# Altium schematic sheet 24_PCIE-PCIE3.0_1x4Lanes_RC_64P.SchDoc
size 594 x 420 mm; SheetNumber: 36; SheetTotal: 43
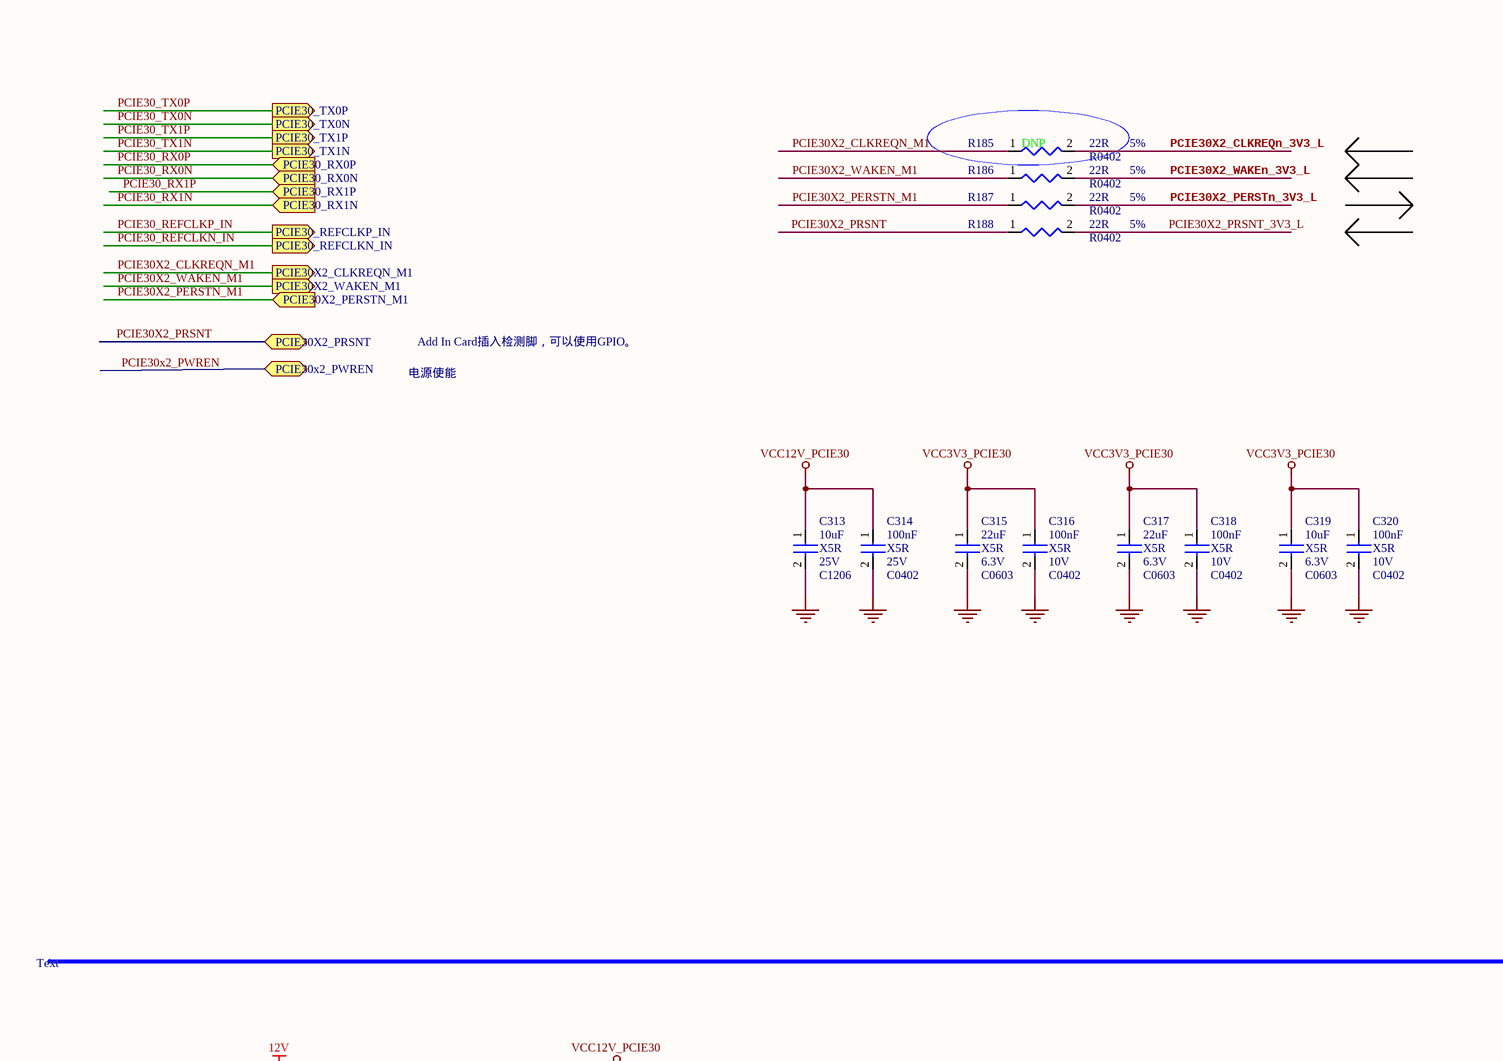
[diagram p0: 24_PCIE-PCIE3.0_1x4Lanes_RC_64P.SchDoc, top left]
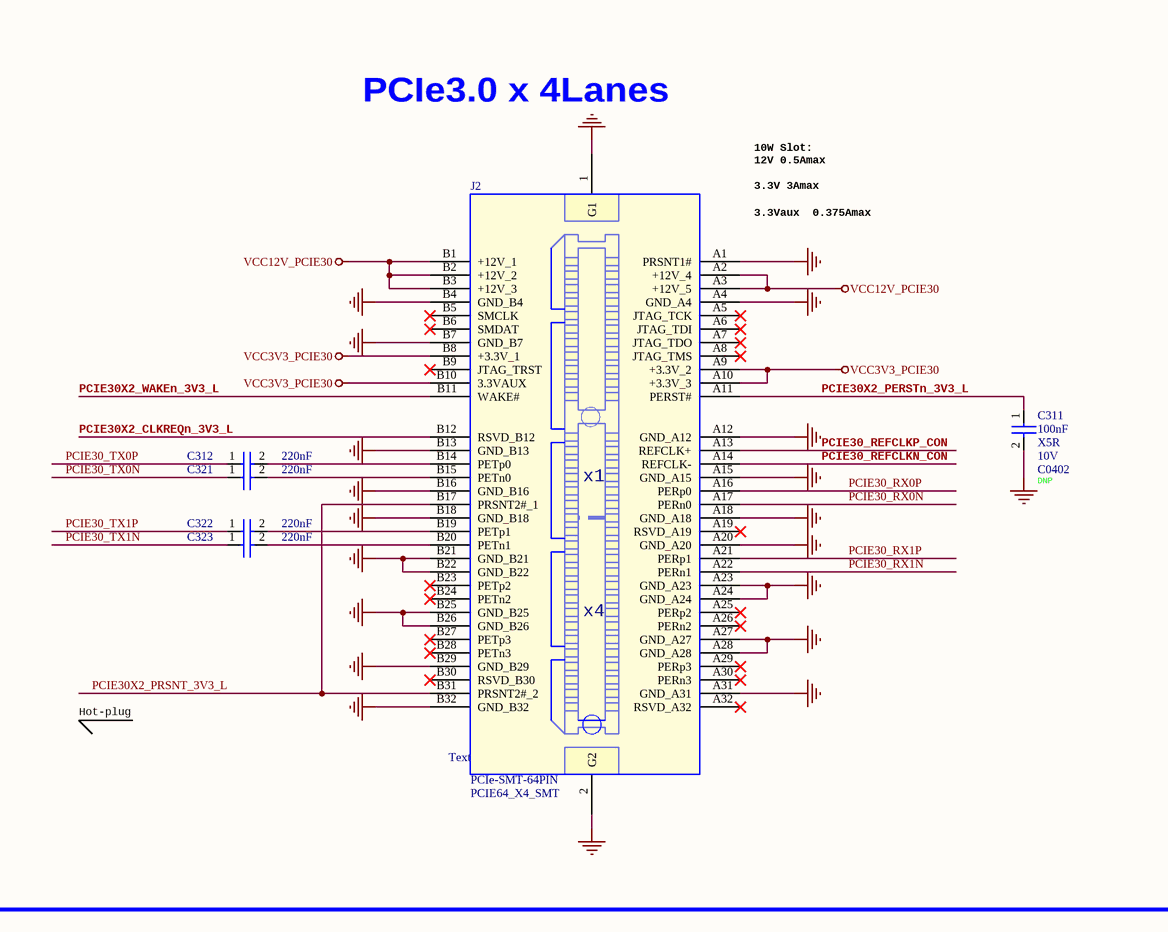
[diagram p1: 24_PCIE-PCIE3.0_1x4Lanes_RC_64P.SchDoc, top right]
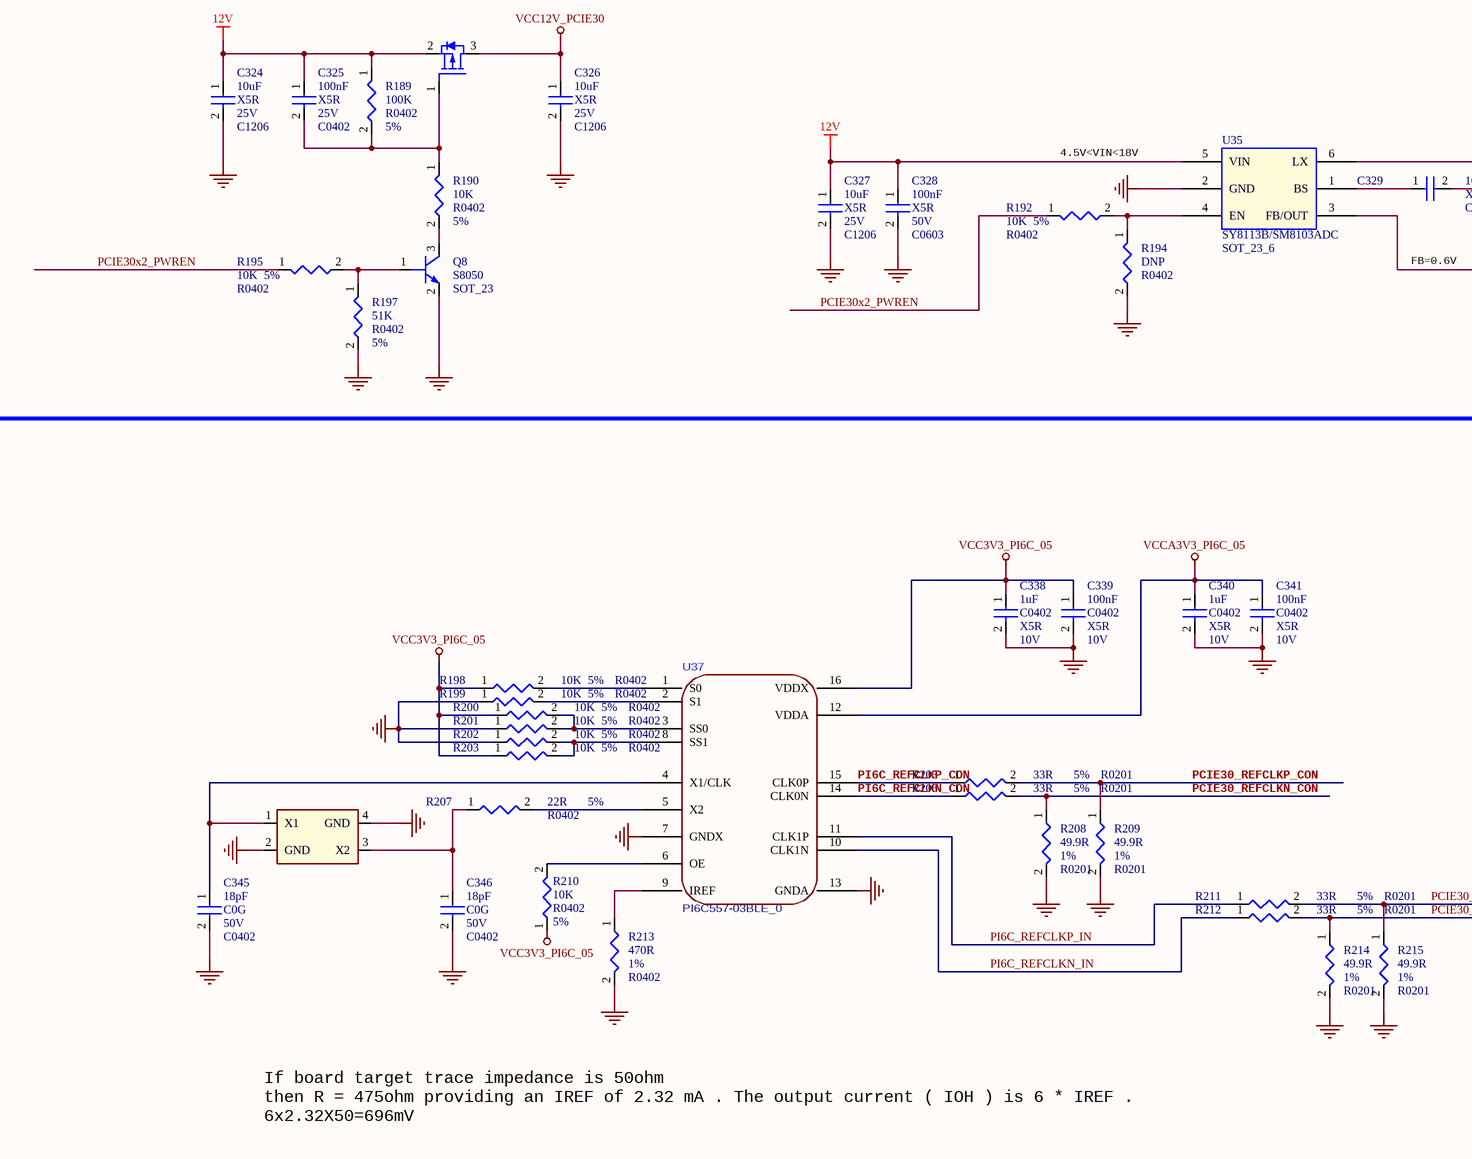
[diagram p2: 24_PCIE-PCIE3.0_1x4Lanes_RC_64P.SchDoc, bottom left]
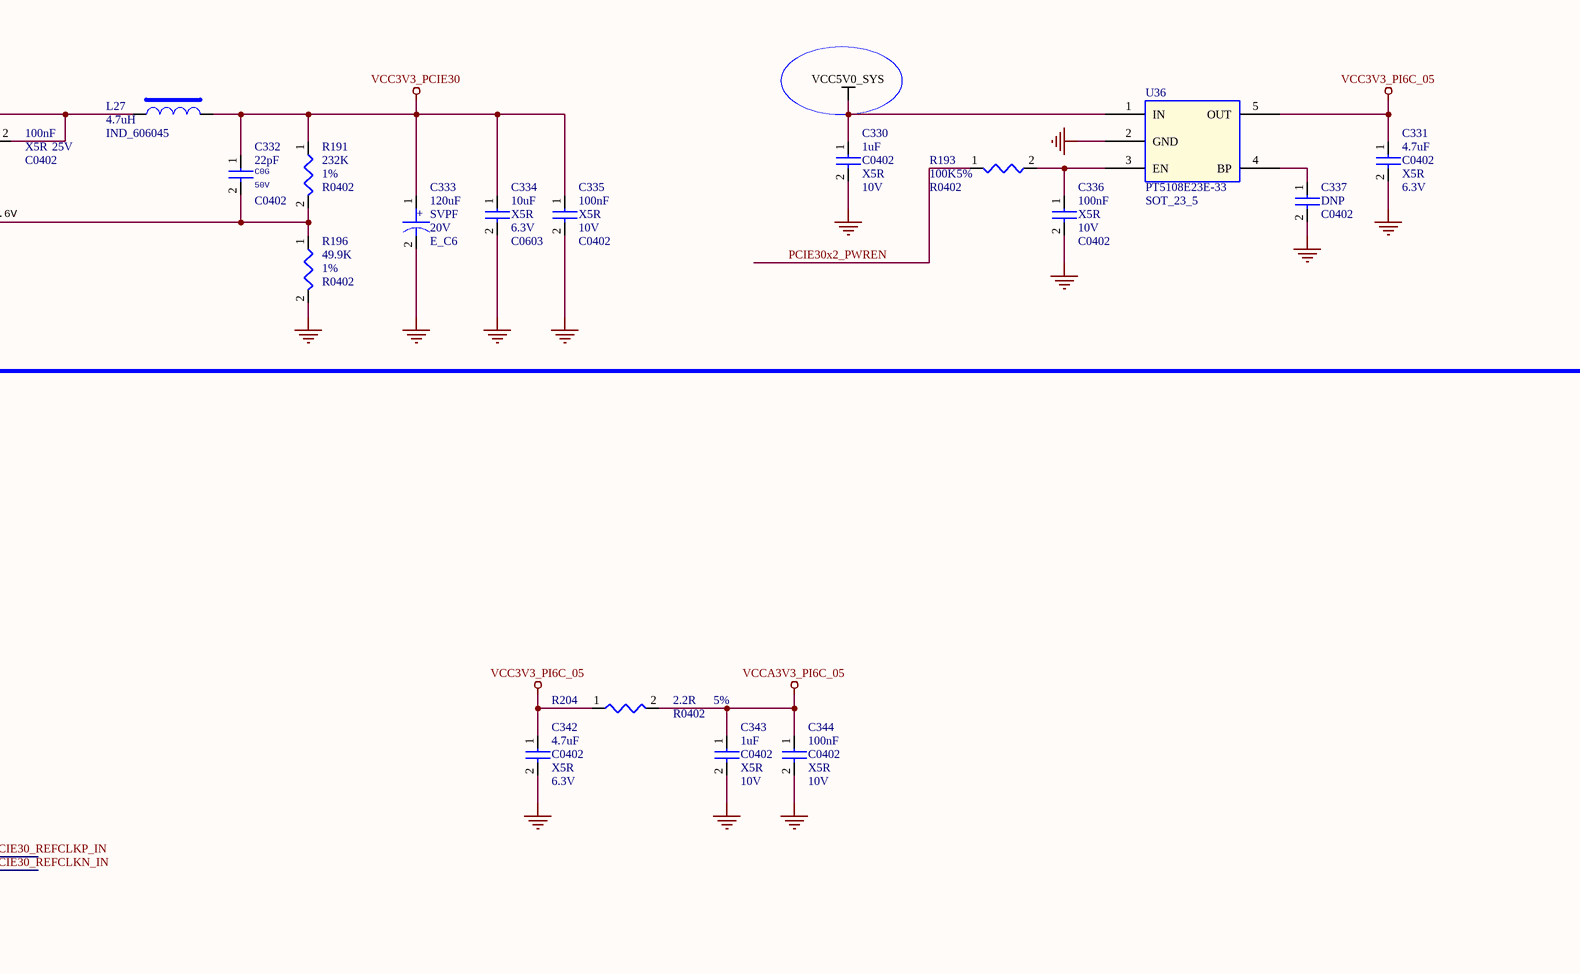
[diagram p3: 24_PCIE-PCIE3.0_1x4Lanes_RC_64P.SchDoc, bottom right]

## Parts
C311  100nF  Voltage: 10V  Dielectric: X5R  option: DNP  [C0402]
C312  220nF  [C0201]
C313  10uF  Voltage: 25V  Dielectric: X5R  [C1206]
C314  100nF  Voltage: 25V  Dielectric: X5R  [C0402]
C315  22uF  Voltage: 6.3V  Dielectric: X5R  [C0603]
C316  100nF  Voltage: 10V  Dielectric: X5R  [C0402]
C317  22uF  Voltage: 6.3V  Dielectric: X5R  [C0603]
C318  100nF  Voltage: 10V  Dielectric: X5R  [C0402]
C319  10uF  Voltage: 6.3V  Dielectric: X5R  [C0603]
C320  100nF  Voltage: 10V  Dielectric: X5R  [C0402]
C321  220nF  [C0201]
C322  220nF  [C0201]
C323  220nF  [C0201]
C324  10uF  Voltage: 25V  Dielectric: X5R  [C1206]
C325  100nF  Voltage: 25V  Dielectric: X5R  [C0402]
C326  10uF  Voltage: 25V  Dielectric: X5R  [C1206]
C327  10uF  Voltage: 25V  Dielectric: X5R  [C1206]
C328  100nF  Voltage: 50V  Dielectric: X5R  [C0603]
C329  100nF  Voltage: 25V  Dielectric: X5R  [C0402]
C330  1uF  Voltage: 10V  Dielectric: X5R  [C0402]
C331  4.7uF  Voltage: 6.3V  Dielectric: X5R  [C0402]
C332  22pF  Voltage: 50V  Dielectric: C0G  [C0402]
C333  120uF  Voltage: 20V  Dielectric: SVPF  [E_C6]
C334  10uF  Voltage: 6.3V  Dielectric: X5R  [C0603]
C335  100nF  Voltage: 10V  Dielectric: X5R  [C0402]
C336  100nF  Voltage: 10V  Dielectric: X5R  [C0402]
C337  DNP  [C0402]
C338  1uF  Voltage: 10V  Dielectric: X5R  [C0402]
C339  100nF  Voltage: 10V  Dielectric: X5R  [C0402]
C340  1uF  Voltage: 10V  Dielectric: X5R  [C0402]
C341  100nF  Voltage: 10V  Dielectric: X5R  [C0402]
C342  4.7uF  Voltage: 6.3V  Dielectric: X5R  [C0402]
C343  1uF  Voltage: 10V  Dielectric: X5R  [C0402]
C344  100nF  Voltage: 10V  Dielectric: X5R  [C0402]
C345  18pF  Voltage: 50V  Dielectric: C0G  [C0402]
C346  18pF  Voltage: 50V  Dielectric: C0G  [C0402]
J2  PCIe-SMT-64PIN  [PCIE64_X4_SMT]
L27  4.7uH  [IND_606045]
Q7  MOSFET P  [SOT_23]  (value not drawn)
Q8  S8050  [SOT_23]
R185  22R  Tolerance: 5%  option: DNP  [R0402]
R186  22R  Tolerance: 5%  [R0402]
R187  22R  Tolerance: 5%  [R0402]
R188  22R  Tolerance: 5%  [R0402]
R189  100K  Tolerance: 5%  [R0402]
R190  10K  Tolerance: 5%  [R0402]
R191  232K  Tolerance: 1%  [R0402]
R192  10K  Tolerance: 5%  [R0402]
R193  100K  Tolerance: 5%  [R0402]
R194  DNP  [R0402]
R195  10K  Tolerance: 5%  [R0402]
R196  49.9K  Tolerance: 1%  [R0402]
R197  51K  Tolerance: 5%  [R0402]
R198  10K  Tolerance: 5%  [R0402]
R199  10K  Tolerance: 5%  [R0402]
R200  10K  Tolerance: 5%  [R0402]
R201  10K  Tolerance: 5%  [R0402]
R202  10K  Tolerance: 5%  [R0402]
R203  10K  Tolerance: 5%  [R0402]
R204  2.2R  Tolerance: 5%  [R0402]
R205  33R  PCB Footprint: R0201  Tolerance: 5%  [R0402]
R206  33R  PCB Footprint: R0201  Tolerance: 5%  [R0402]
R207  22R  Tolerance: 5%  [R0402]
R208  49.9R  PCB Footprint: R0201  Tolerance: 1%  [R0402]
R209  49.9R  PCB Footprint: R0201  Tolerance: 1%  [R0402]
R210  10K  Tolerance: 5%  [R0402]
R211  33R  PCB Footprint: R0201  Tolerance: 5%  [R0402]
R212  33R  PCB Footprint: R0201  Tolerance: 5%  [R0402]
R213  470R  Tolerance: 1%  [R0402]
R214  49.9R  PCB Footprint: R0201  Tolerance: 1%  [R0402]
R215  49.9R  PCB Footprint: R0201  Tolerance: 1%  [R0402]
U35  SY8113B/SM8103ADC  [SOT_23_6]
U36  PT5108E23E-33  [SOT_23_5]
U37  PI6C557-03BLE_0  [TSSOP-16_L5.0-W4.4-P0.65-LS6.4-BL]
Y3  CRYSTAL_4P  [CRY4_3R20X2R50X0R80]  (value not drawn)

## Ports
PCIE30_REFCLKN_IN (out), PCIE30_REFCLKP_IN (out), PCIE30_RX0N (in), PCIE30_RX0P (in), PCIE30_RX1N (in), PCIE30_RX1P (in), PCIE30_TX0N (out), PCIE30_TX0P (out), PCIE30_TX1N (out), PCIE30_TX1P (out), PCIE30X2_CLKREQN_M1 (out), PCIE30X2_PERSTN_M1 (in), PCIE30X2_PRSNT (bidir), PCIE30x2_PWREN (bidir), PCIE30X2_WAKEN_M1 (out)

## Nets
12V: C324.1 C325.1 C327.1 C328.1 Q7.2(SOURCE) R189.1 U35.5(VIN)
GND: C311.2 C313.2 C314.2 C315.2 C316.2 C317.2 C318.2 C319.2 C320.2 C324.2 C326.2 C327.2 C328.2 C330.2 C331.2 C333.2 C334.2 C335.2 C336.2 C337.2 C338.2 C339.2 C340.2 C341.2 C342.2 C343.2 C344.2 C345.2 C346.2 J2.1(G1) J2.2(G2) J2.A1(PRSNT1#) J2.A4(GND_A4) J2.A12(GND_A12) J2.A15(GND_A15) J2.A18(GND_A18) J2.A20(GND_A20) J2.A23(GND_A23) J2.A24(GND_A24) J2.A27(GND_A27) J2.A28(GND_A28) J2.A31(GND_A31) J2.B4(GND_B4) J2.B7(GND_B7) J2.B13(GND_B13) J2.B16(GND_B16) J2.B18(GND_B18) J2.B21(GND_B21) J2.B22(GND_B22) J2.B25(GND_B25) J2.B26(GND_B26) J2.B29(GND_B29) J2.B32(GND_B32) Q8.2(EMITTER) R194.2 R196.2 R197.2 R199.1 R201.1 R202.1 R208.2 R209.2 R213.2 R214.2 R215.2 U35.2(GND) U36.2(GND) U37.7(GNDX) U37.13(GNDA) Y3.2(GND) Y3.4(GND)
VCC3V3_PCIE30: C315.1 C316.1 C317.1 C318.1 C319.1 C320.1 C332.1 C333.1 C334.1 C335.1 J2.A9(+3.3V_2) J2.A10(+3.3V_3) J2.B8(+3.3V_1) J2.B10(3.3VAUX) L27.2 R191.1
VCC3V3_PI6C_05: C331.1 C338.1 C339.1 C342.1 R198.1 R200.1 R203.1 R204.1 R210.1 U36.5(OUT) U37.16(VDDX)
VCC5V0_SYS: C330.1 U36.1(IN)
VCC12V_PCIE30: C313.1 C314.1 C326.1 J2.A2(+12V_4) J2.A3(+12V_5) J2.B1(+12V_1) J2.B2(+12V_2) J2.B3(+12V_3) Q7.3(DRAIN)
VCCA3V3_PI6C_05: C340.1 C341.1 C343.1 C344.1 R204.2 U37.12(VDDA)
PCIE30_REFCLKN_CON: J2.A14(REFCLK-) R206.2 R208.1
PCIE30_REFCLKN_IN: R212.2 R214.1 ; port PCIE30_REFCLKN_IN
PCIE30_REFCLKP_CON: J2.A13(REFCLK+) R205.2 R209.1
PCIE30_REFCLKP_IN: R211.2 R215.1 ; port PCIE30_REFCLKP_IN
PCIE30_RX0N: J2.A17(PERn0) ; port PCIE30_RX0N
PCIE30_RX0P: J2.A16(PERp0) ; port PCIE30_RX0P
PCIE30_RX1N: J2.A22(PERn1) ; port PCIE30_RX1N
PCIE30_RX1P: J2.A21(PERp1) ; port PCIE30_RX1P
PCIE30_TX0N: C321.1 ; port PCIE30_TX0N
PCIE30_TX0P: C312.1 ; port PCIE30_TX0P
PCIE30_TX1N: C323.1 ; port PCIE30_TX1N
PCIE30_TX1P: C322.1 ; port PCIE30_TX1P
PCIE30X2_CLKREQn_3V3_L: J2.B12(RSVD_B12) R185.2
PCIE30X2_CLKREQN_M1: R185.1 ; port PCIE30X2_CLKREQN_M1
PCIE30X2_PERSTn_3V3_L: C311.1 J2.A11(PERST#) R187.2
PCIE30X2_PERSTN_M1: R187.1 ; port PCIE30X2_PERSTN_M1
PCIE30X2_PRSNT: R188.1 ; port PCIE30X2_PRSNT
PCIE30X2_PRSNT_3V3_L: J2.B17(PRSNT2#_1) J2.B31(PRSNT2#_2) R188.2
PCIE30x2_PWREN: R192.1 R193.1 R195.1 ; port PCIE30x2_PWREN
PCIE30X2_WAKEn_3V3_L: J2.B11(WAKE#) R186.2
PCIE30X2_WAKEN_M1: R186.1 ; port PCIE30X2_WAKEN_M1
PI6C_REFCLKN_CON: R206.1 U37.14(CLK0N)
PI6C_REFCLKN_IN: R212.1 U37.10(CLK1N)
PI6C_REFCLKP_CON: R205.1 U37.15(CLK0P)
PI6C_REFCLKP_IN: R211.1 U37.11(CLK1P)
NetC312_2: C312.2 J2.B14(PETp0)
NetC321_2: C321.2 J2.B15(PETn0)
NetC322_2: C322.2 J2.B19(PETp1)
NetC323_2: C323.2 J2.B20(PETn1)
NetC325_2: C325.2 Q7.1(GATE) R189.2 R190.1
NetC329_1: C329.1 U35.1(BS)
NetC329_2: C329.2 L27.1 U35.6(LX)
NetC332_2: C332.2 R191.2 R196.1 U35.3(FB/OUT)
NetC336_1: C336.1 R193.2 U36.3(EN)
NetC337_1: C337.1 U36.4(BP)
NetC345_1: C345.1 U37.4(X1/CLK) Y3.1(X1)
NetC346_1: C346.1 R207.1 Y3.3(X2)
NetQ8_1: Q8.1(BASE) R195.2 R197.1
NetQ8_3: Q8.3(COLLECTOR) R190.2
NetR192_2: R192.2 R194.1 U35.4(EN)
NetR198_2: R198.2 U37.1(S0)
NetR199_2: R199.2 U37.2(S1)
NetR200_2: R200.2 R201.2 U37.3(SS0)
NetR202_2: R202.2 R203.2 U37.8(SS1)
NetR207_2: R207.2 U37.5(X2)
NetR210_2: R210.2 U37.6(OE)
NetR213_1: R213.1 U37.9(IREF)

Not connected (* = marked no-connect by the designer): J2 A5(JTAG_TCK)* A6(JTAG_TDI)* A7(JTAG_TDO)* A8(JTAG_TMS)* A19(RSVD_A19)* A25(PERp2)* A26(PERn2)* A29(PERp3)* A30(PERn3)* A32(RSVD_A32)* B5(SMCLK)* B6(SMDAT)* B9(JTAG_TRST)* B23(PETp2)* B24(PETn2)* B27(PETp3)* B28(PETn3)* B30(RSVD_B30)*

## Notes on the sheet
- PCIe3.0 x 4Lanes
- 10W Slot:
  12V 0.5Amax
- 3.3V 3Amax
- 3.3Vaux  0.375Amax
- Add In Card插入检测脚，可以使用GPIO。
- 电源使能
- Hot-plug
- (near J2) Text
- Text
- 4.5V<VIN<18V
- FB=0.6V
- If board target trace impedance is 50ohm
  then R = 475ohm providing an IREF of 2.32 mA . The output current ( IOH ) is 6 * IREF .
  6x2.32X50=696mV
- (in symbol CAP) +
- (in symbol PCIeX4_1) x1; x4

## Library data of the parts
C311 C339 C341 C344 = CAP NP: cap,100.00nF,+/-10%,10V,X5R,C0402; Manufacturer: TDK; RK PN: C1005X5R1A104K050BA; Priority: A; Tolerance: 10%; PCB Footprint: C0402; Part Type: C0402; Manufacturer PN: C1005X5R1A104K050BA; Created by: JJJ
C312 C321-C323 = CAP NP: cap,220.00nF,+/-10%,10V,X5R,C0201; Manufacturer PN: C0603X5R1A224K030BB; Manufacturer: TDK; Tolerance: 10%; Priority: A; Created by: JJJ; Part Type: C0201; RK PN: C0603X5R1A224K030BB
C313 C327 = CAP NP: cap,10.00uF,+/-10%,25V,X5R,C1206; Manufacturer PN: C3216X5R1E106K085AC; Manufacturer: TDK; Tolerance: 10%; C_Voltage: 6.3V; Priority: A; PCB Footprint: C1206; Created by: JJJ; Part Type: C1206; RK PN: C3216X5R1E106K085AC
C314 C329 = CAP NP: cap,100.00nF,+/-10%,25V,X5R,C0402; Manufacturer: TDK; Number: 37; RK PN: C1005X5R1E104K050BC; Priority: A; Tolerance: 10%; C_Voltage: 6.3V; PCB Footprint: C0402; Part Type: C0402; Manufacturer PN: C1005X5R1E104K050BC; Created by: JJJ
C315 C317 = CAP NP: cap,22.00uF,+/-20%,6.3V,X5R,C0603; Manufacturer PN: C1608X5R0J226M080AC; Manufacturer: TDK; Tolerance: 20%; Priority: A; PCB Footprint: C0603; Created by: JJJ; C_Voltage: 6.3V; Part Type: C0603; RK PN: C1608X5R0J226M080AC
C316 C318 C335 = CAP NP: cap,100.00nF,+/-10%,10V,X5R,C0402; Manufacturer PN: C1005X5R1A104K050BA; Manufacturer: TDK; C_Voltage: 6.3V; Tolerance: 10%; Priority: A; Number: 37; PCB Footprint: C0402; Created by: JJJ; Part Type: C0402; RK PN: C1005X5R1A104K050BA
C319 C334 = CAP NP: cap,10.00uF,+/-10%,6.3V,X5R,C0603; Manufacturer: TDK; RK PN: C1608X5R0J106K080AB; Priority: A; Tolerance: 10%; PCB Footprint: C0603; Part Type: C0603; C_Voltage: 6.3V; Manufacturer PN: C1608X5R0J106K080AB; Created by: JJJ
C320 C336 = CAP NP: cap,100.00nF,+/-10%,10V,X5R,C0402; Manufacturer: TDK; Number: 37; RK PN: C1005X5R1A104K050BA; Priority: A; Tolerance: 10%; C_Voltage: 6.3V; PCB Footprint: C0402; Part Type: C0402; Manufacturer PN: C1005X5R1A104K050BA; Created by: JJJ
C324 C326 = CAP NP: cap,10.00uF,+/-10%,25V,X5R,C1206; Manufacturer: TDK; RK PN: C3216X5R1E106K085AC; Priority: A; C_Voltage: 6.3V; Tolerance: 10%; PCB Footprint: C1206; Part Type: C1206; Manufacturer PN: C3216X5R1E106K085AC; Created by: JJJ
C325 = CAP NP: cap,100.00nF,+/-10%,25V,X5R,C0402; Manufacturer PN: C1005X5R1E104K050BC; Manufacturer: TDK; C_Voltage: 6.3V; Tolerance: 10%; Priority: A; Number: 37; PCB Footprint: C0402; Created by: JJJ; Part Type: C0402; RK PN: C1005X5R1E104K050BC
C328 = CAP NP: cap,100.00nF,+/-10%,50V,X5R,C0603; Manufacturer PN: C1608X5R1H104K080AA; Manufacturer: TDK; Tolerance: 10%; Priority: A; PCB Footprint: C0603; Created by: JJJ; Part Type: C0603; RK PN: C1608X5R1H104K080AA
C330 = CAP NP: cap,1.00uF,+/-10%,10V,X5R,C0402; Manufacturer: TDK; RK PN: C1005X5R1A105K050BB; Priority: A; Tolerance: 10%; PCB Footprint: C0402; Part Type: C0402; Manufacturer PN: C1005X5R1A105K050BB; Created by: JJJ
C331 = CAP NP: cap,4.70uF,+/-10%,6.3V,X5R,C0402; Manufacturer PN: C1005X5R0J475K050BC; Manufacturer: TDK; Tolerance: 10%; Priority: A; PCB Footprint: C0402; Created by: JJJ; Part Type: C0402; RK PN: C1005X5R0J475K050BC
C332 = CAP NP: cap,22.00pF,+/-5%,50V,C0G,C0402; Manufacturer: TDK; RK PN: C1005C0G1H220J050BA; Priority: A; Tolerance: 5%; PCB Footprint: C0402; Part Type: C0402; Manufacturer PN: C1005C0G1H220J050BA; Created by: JJJ
C333 = CAP: 120uF,20V,25mR,SVPF; Manufacturer PN: 25SVPF100M; Manufacturer: Panasonic; Tolerance: 20%; Priority: A; PCB Footprint: E_C6; Created by: JJJ; Part Type: 贴片固态铝电解; RK PN: 25SVPF100M
C337 = CAP NP: Did Not Place.; Manufacturer PN: DNPC0402; Priority: A; PCB Footprint: C0402; Created by: JJJ; Part Type: DNP; RK PN: DNPC0402
C338 C340 C343 = CAP NP: cap,1.00uF,+/-10%,10V,X5R,C0402; Manufacturer PN: C1005X5R1A105K050BB; Manufacturer: TDK; Tolerance: 10%; Priority: A; PCB Footprint: C0402; Created by: JJJ; Part Type: C0402; RK PN: C1005X5R1A105K050BB
C342 = CAP NP: cap,4.70uF,+/-10%,6.3V,X5R,C0402; Manufacturer: TDK; RK PN: C1005X5R0J475K050BC; Priority: A; Tolerance: 10%; PCB Footprint: C0402; Part Type: C0402; Manufacturer PN: C1005X5R0J475K050BC; Created by: JJJ
C345 = CAP NP: cap,18.00pF,+/-5%,50V,C0G,C0402; Manufacturer: TDK; Number: 37; RK PN: C1005C0G1H180J050BA; Priority: A; Tolerance: 5%; C_Voltage: 6.3V; PCB Footprint: C0402; Part Type: C0402; Manufacturer PN: C1005C0G1H180J050BA; Created by: JJJ
C346 = CAP NP: cap,18.00pF,+/-5%,50V,C0G,C0402; Manufacturer PN: C1005C0G1H180J050BA; Manufacturer: TDK; C_Voltage: 6.3V; Tolerance: 5%; Priority: A; Number: 37; PCB Footprint: C0402; Created by: JJJ; Part Type: C0402; RK PN: C1005C0G1H180J050BA
J2 = PCIeX4_1: PCB Footprint: PCIE64_X4_SMT
L27 = INDUCTORS OF FERRITE_Dup1: Power Inductor,4.7uH,0.2,IND_606045; Manufacturer PN: SWPA6045S4R7MT; Manufacturer: sunlord; Isat: 4.97A; DC Resistor: 0.02ohm; Resonace frequency: 24M; Irms: 3.3A; Tolerance: 20%; Priority: A; PCB Footprint: IND_606045; Created by: YWQ; Part Type: POWER_IND; RK PN: SWPA6045S4R7MT
Q8 = NPN: S8050,SOT23; Manufacturer: 长电; Manufacturer PN: S8050_SOT23; Priority: A; Ic: 0.5A; Vceo: 25V; Pc: 0.3W; PCB Footprint: SOT_23; RK PN: S8050; Part Type: NPN; Created by: JJJ
R185 R187 = RESISTOR_Dup1: 通用厚膜电阻,22R,+/-5%,R0402,1/16W.; Manufacturer PN: RC0402JR-0722RL; Manufacturer: YAGEO; Wattage: 1/16W; Priority: A; PCB Footprint: R0402; Created by: YTL; Part Type: 通用厚膜电阻; RK PN: RC0402JR-0722RL
R186 R188 R207 = RESISTOR_Dup1: 通用厚膜电阻,22R,+/-5%,R0402,1/16W.; Manufacturer: YAGEO; RK PN: RC0402JR-0722RL; Priority: A; Wattage: 1/16W; PCB Footprint: R0402; Part Type: 通用厚膜电阻; Manufacturer PN: RC0402JR-0722RL; Created by: YTL
R189 = RESISTOR_Dup1: 通用厚膜电阻,100K,+/-5%,R0402,1/16W.; Manufacturer PN: RC0402JR-07100KL; Manufacturer: YAGEO; Wattage: 1/16W; Priority: A; PCB Footprint: R0402; Created by: YTL; Part Type: 通用厚膜电阻; RK PN: RC0402JR-07100KL
R190 R192 = RESISTOR_Dup1: 通用厚膜电阻,10K,+/-5%,R0402,1/16W.; Manufacturer PN: RC0402JR-0710KL; Manufacturer: YAGEO; Wattage: 1/16W; Priority: A; PCB Footprint: R0402; Created by: YTL; Part Type: 通用厚膜电阻; RK PN: RC0402JR-0710KL
R191 = RESISTOR_Dup1: 通用厚膜电阻,232K,+/-1%,R0402,1/16W.; Manufacturer: YAGEO; RK PN: RC0402FR-07232KL; Priority: A; Wattage: 1/16W; PCB Footprint: R0402; Part Type: 通用厚膜电阻; Manufacturer PN: RC0402FR-07232KL; Created by: YTL
R193 = RESISTOR_Dup1: 通用厚膜电阻,100K,+/-5%,R0402,1/16W.; Manufacturer: YAGEO; RK PN: RC0402JR-07100KL; Priority: A; Wattage: 1/16W; PCB Footprint: R0402; Part Type: 通用厚膜电阻; Manufacturer PN: RC0402JR-07100KL; Created by: YTL
R194 = RESISTOR_Dup1: Did Not Place.; RK PN: DNPR0402; Priority: A; PCB Footprint: R0402; Part Type: DNP; Manufacturer PN: DNPR0402; Created by: JJJ
R195 R198-R203 R210 = RESISTOR_Dup1: 通用厚膜电阻,10K,+/-5%,R0402,1/16W.; Manufacturer: YAGEO; RK PN: RC0402JR-0710KL; Priority: A; Wattage: 1/16W; PCB Footprint: R0402; Part Type: 通用厚膜电阻; Manufacturer PN: RC0402JR-0710KL; Created by: YTL
R196 = RESISTOR_Dup1: 通用厚膜电阻,49K9,+/-1%,R0402,1/16W.; Manufacturer PN: RC0402FR-0749K9L; Manufacturer: YAGEO; Wattage: 1/16W; Priority: A; PCB Footprint: R0402; Created by: YTL; Part Type: 通用厚膜电阻; RK PN: RC0402FR-0749K9L
R197 = RESISTOR_Dup1: 通用厚膜电阻,51K,+/-5%,R0402,1/16W.; Manufacturer PN: RC0402JR-0751KL; Manufacturer: YAGEO; Wattage: 1/16W; Priority: A; PCB Footprint: R0402; Created by: YTL; Part Type: 通用厚膜电阻; RK PN: RC0402JR-0751KL
R204 = RESISTOR_Dup1: 通用厚膜电阻,2R2,+/-5%,R0402,1/16W.; Manufacturer PN: RC0402JR-072R2L; Manufacturer: YAGEO; Wattage: 1/16W; Priority: A; PCB Footprint: R0402; Created by: YTL; Part Type: 通用厚膜电阻; RK PN: RC0402JR-072R2L
R205 R206 R211 R212 = RESISTOR_Dup1: 通用厚膜电阻,33R,+/-5%,R0201,1/20W.; Manufacturer PN: RC0201JR-0733RL; Manufacturer: YAGEO; Wattage: 1/20W; Priority: A; Created by: YTL; Part Type: 通用厚膜电阻; RK PN: RC0201JR-0733RL
R208 R209 R214 R215 = RESISTOR_Dup1: 通用厚膜电阻,49R9,+/-1%,R0201,1/20W.; Manufacturer PN: RC0201FR-0749R9L; Manufacturer: YAGEO; Wattage: 1/20W; Priority: A; Created by: YTL; Part Type: 通用厚膜电阻; RK PN: RC0201FR-0749R9L
R213 = RESISTOR_Dup1: 通用厚膜电阻,470R,+/-1%,R0402,1/16W.; Manufacturer PN: RC0402FR-07470RL; Manufacturer: YAGEO; Wattage: 1/16W; Priority: A; PCB Footprint: R0402; Created by: YTL; Part Type: 通用厚膜电阻; RK PN: RC0402FR-07470RL
U35 = DCDC_SY8113: Manufacturer: Silergy（矽力杰）; Priority: A; PCB Footprint: SOT_23_6; Created by: JJJ; Manufacturer PN: SY8113B; Part Type: DCDC; RK PN: SY8113B
U36 = LDO_PT5108: High-PSRR 600mA LDO.Output3.3V.; Manufacturer: Powtech（华润矽威）; Priority: A; PCB Footprint: SOT_23_5; Created by: JJJ; Manufacturer PN: PT5108E23E-33; Part Type: LDO; RK PN: PT5108E23E-33